# EAGLE design SimpleDuino (EAGLE 9.6.2)
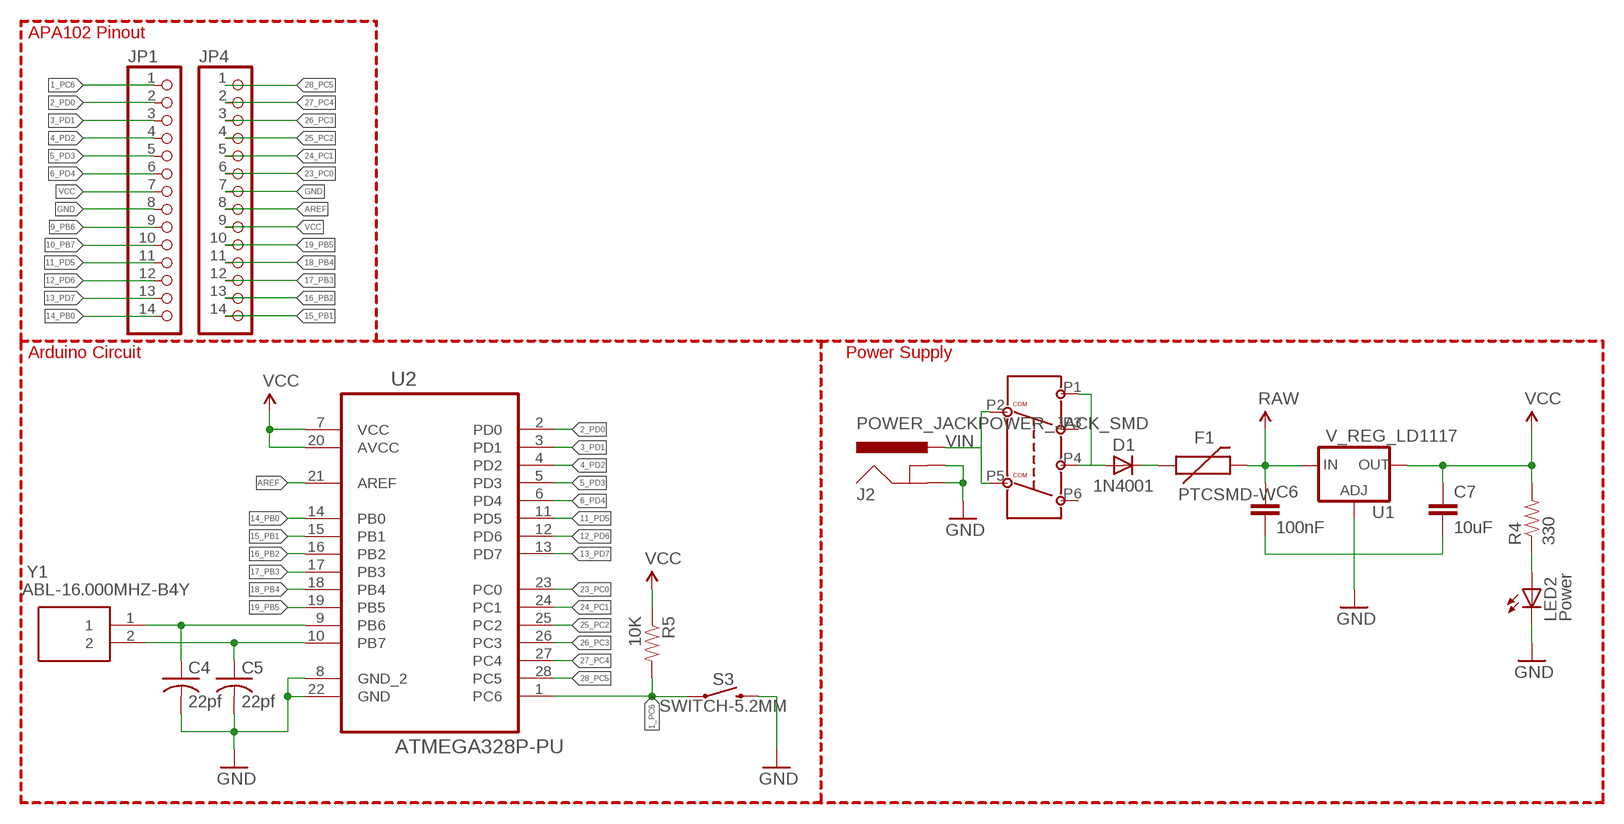
[diagram p0: schematic, sheet 1]

## Parts
C4  22pf  C-USC0805  [C0805]
C5  22pf  C-USC0805  [C0805]
C6  100nF  CAP0603-CAP  [0603-CAP]
C7  10uF  CAP0603-CAP  [0603-CAP]
D1  1N4001  1N4004  [DO41-10]
F1  PTCSMD-W  [PTC-1206-WIDE]
J2  POWER_JACKPOWER_JACK_SMD  [POWER_JACK_SMD]
JP1  PINHD-1X14  [1X14]
JP4  PINHD-1X14  [1X14]
LED2  Power  LED1206  [LED-1206]
POWER_SWITCH  6-PIN-SLIDE-SWITCH  [6-PIN-SLIDE-SWITCH]
R4  330  RESISTOR0603-RES  [0603-RES]
R5  10K  RESISTOR0603-RES  [0603-RES]
S3  SWITCH-5.2MM  MOMENTARY-SWITCH-SPST-SMD-5.2MM  [TACTILE_SWITCH_SMD_5.2MM]
U1  V_REG_LD1117  V_REG_317SMD  [SOT223]
U2  ATMEGA328P-PU  [DIP254P762X457-28]
Y1  ABL-16.000MHZ-B4Y  [HC/49US_(AT49)PTH]

## Nets
1_PC6: JP1.1 R5.2 S3.1 U2.1(PC6)
2_PD0: JP1.2 U2.2(PD0)
3_PD1: JP1.3 U2.3(PD1)
4_PD2: JP1.4 U2.4(PD2)
5_PD3: JP1.5 U2.5(PD3)
6_PD4: JP1.6 U2.6(PD4)
9_PB6: C4.1 JP1.9 U2.9(PB6) Y1.1
10_PB7: C5.1 JP1.10 U2.10(PB7) Y1.2
11_PD5: JP1.11 U2.11(PD5)
12_PD6: JP1.12 U2.12(PD6)
13_PD7: JP1.13 U2.13(PD7)
14_PB0: JP1.14 U2.14(PB0)
15_PB1: JP4.14 U2.15(PB1)
16_PB2: JP4.13 U2.16(PB2)
17_PB3: JP4.12 U2.17(PB3)
18_PB4: JP4.11 U2.18(PB4)
19_PB5: JP4.10 U2.19(PB5)
23_PC0: JP4.6 U2.23(PC0)
24_PC1: JP4.5 U2.24(PC1)
25_PC2: JP4.4 U2.25(PC2)
26_PC3: JP4.3 U2.26(PC3)
27_PC4: JP4.2 U2.27(PC4)
28_PC5: JP4.1 U2.28(PC5)
AREF: JP4.8 U2.21(AREF)
GND: C4.2 C5.2 C6.2 C7.2 J2.GND J2.P$4(GNDBREAK) JP1.8 JP4.7 LED2.C S3.3 U1.1(ADJ) U2.8(GND_2) U2.22(GND)
N$1: D1.C F1.1
N$8: LED2.A R4.1
N$9: D1.A POWER_SWITCH.P1 POWER_SWITCH.P4
RAW: C6.1 F1.2 U1.3(IN)
VCC: C7.1 JP1.7 JP4.9 R4.2 R5.1 U1.2(OUT) U2.7(VCC) U2.20(AVCC)
VIN: J2.VIN0(PWR) POWER_SWITCH.P2 POWER_SWITCH.P5
Unconnected: POWER_SWITCH.P3 POWER_SWITCH.P6

## Notes on the sheet
- APA102 Pinout
- Arduino Circuit | Power Supply

## Library data of the parts
C4 C5 = resistor:C-US: CAPACITOR, American symbol
C6 C7 = SparkFun:CAP: Capacitor Standard 0603 ceramic capacitor, and 0.1" leaded capacitor.
D1 = adafruit:1N4004: DIODE General purpose 1N400x type rectifier (With bigger pads) http://www.ladyada.net/library/pcb/eaglelibrary.html
F1 = SparkFun-PowerIC:PTC: Resettable Fuse PTC Resettable Fuse. Spark Fun Electronics SKU : COM-08357
J2 = Magister-Libraries:POWER_JACK: Power Jack Connector This is the standard 5.5mm barrel jack for power. The PTH is the most common, proven, reliable, footprint. The Slot footprint only works if the mill layer is transmitted to the PCB fab house so be warned. Here are the connectors we sell at SparkFun: DC Barrel Power Jack/Connector <https://www.sparkfun.com/products/119> (PRT-00119) DC Barrel Power Jack/Connector (SMD) <https://www.sparkfun.com/products/12748> (PRT-12748) DC Barrel Jack Adapter - Breadboard Compatible <https://www.sparkfun.com/products/10811> (PRT-10811) It is used on this SparkFun product (and many, many others): SparkFun RedBoard - Programmed with Arduino <https://www.sparkfun.com/products/12757> (DEV-12757) Also, if you need a mating power supply or connector, please check these out: Wall Adapter Power Supply - 9VDC 650mA <https://www.sparkfun.com/products/298> (TOL-00298) DC Barrel Jack Adapter - Male <https://www.sparkfun.com/products/10287> (PRT-10287)
JP1 JP4 = pinhead:PINHD-1X14: PIN HEADER
LED2 = SparkFun-Nate:LED
POWER_SWITCH = Magister-Libraries:6-PIN-SLIDE-SWITCH
R4 R5 = SparkFun:RESISTOR: Resistor Basic schematic elements and footprints for 0603, 1206, and PTH resistors.
S3 = SparkFun-Switches:MOMENTARY-SWITCH-SPST: Momentary Switch (Pushbutton) - SPST Normally-open (NO) SPST momentary switches (buttons, pushbuttons). Variants PTH-12MM - 12mm square, through-hole Momentary Pushbutton Switch - 12mm Square <https://www.sparkfun.com/products/9190> (COM-09190) PTH-6.0MM, PTH-6.0MM-KIT - 6.0mm square, through-hole Mini Pushbutton Switch <https://www.sparkfun.com/products/97> (COM-00097) KIT package intended for soldering kit's - only one side of pads' copper is exposed. PTH-RIGHT-ANGLE-KIT - Right-angle, through-hole Right Angle Tactile Button <https://www.sparkfun.com/products/10791> - Used on SparkFun BigTime Watch Kit <https://www.sparkfun.com/products/11734> SMD-12MM - 12mm square, surface-mount Tactile Button - SMD (12mm) <https://www.sparkfun.com/products/12993> (COM-12993) Used on SparkFun PicoBoard <https://www.sparkfun.com/products/11888> SMD-4.5MM - 4.5mm Square Trackball Switch Used on SparkFun Blackberry Trackballer Breakout <https://www.sparkfun.com/products/13169> SMD-4.6MMX2.8MM - 4.60mm x 2.80mm, surface mount Used on SparkFun SAMD21 Mini Breakout <https://www.sparkfun.com/products/13664> SMD-5.2MM, SMD-5.2-REDUNDANT - 5.2mm square, surface-mount Mini Pushbutton Switch - SMD <https://www.sparkfun.com/products/8720> (COM-08720) Used on Arduino Pro Mini <https://www.sparkfun.com/products/11114> REDUNDANT package connects both switch circuits together SMD-6.0X3.5MM - 6.0 x 3.5mm, surface mount Momentary Reset Switch SMD <https://www.sparkfun.com/products/8229> (COM-08229) SMD-6.2MM-TALL - 6.2mm square, surface mount Tactile Button - SMD (6mm) <https://www.sparkfun.com/products/12992> Used on SparkFun Digital Sandbox <https://www.sparkfun.com/products/12651> SMD-RIGHT-ANGLE - Right-angle, surface mount Used on SparkFun Block for Intel® Edison - Arduino <https://www.sparkfun.com/products/13036>; PROD_ID: SWCH-08247; SF_SKU: COM-08720
U1 = SparkFun:V_REG_317: Voltage Regulator Standard LM317 adjustable voltage regulator. AOI (Adjust Output Input). Google 'LM317 Calculator' for easy to use app to get the two resistor values needed. 240/720 for 5V output. 240/390 for 3.3V output. Spark Fun Electronics SKU : COM-00527
U2 = ATMEGA328P-PU:ATMEGA328P-PU: 8-bit Microcontroller with In-System Programmable Flash; AVAILABILITY: Unavailable; DESCRIPTION: AVR AVR® ATmega Microcontroller IC 8-Bit 20MHz 32KB _16K x 16_ FLASH 28-PDIP; MF: Microchip; MP: ATMEGA328P-PU; PACKAGE: PDIP-28 Microchip; PRICE: None
Y1 = Magister-Libraries:ABL-16.000MHZ-B4Y: Crystals 16.000MHZ, 18pF 30ppm -20C +70C Source: Datasheet <https://abracon.com/Resonators/ABL.pdf>; DESCRIPTION: Crystals 16.000MHZ, 18pF 30ppm -20C +70C; HEIGHT: mm; MANUFACTURER_NAME: ABRACON; MANUFACTURER_PART_NUMBER: ABL-16.000MHz-B4Y; MOUSER_PART_NUMBER: 815-ABL-16-B4Y; MOUSER_PRICE-STOCK: https://www.mouser.co.uk/ProductDetail/ABRACON/ABL-16000MHz-B4Y?qs=DZ%2FvJMgWWIsyUPmWNxNaQw%3D%3D

## Net classes
0 default: width 0.203 mm
1 power: width 0.508 mm

## Board
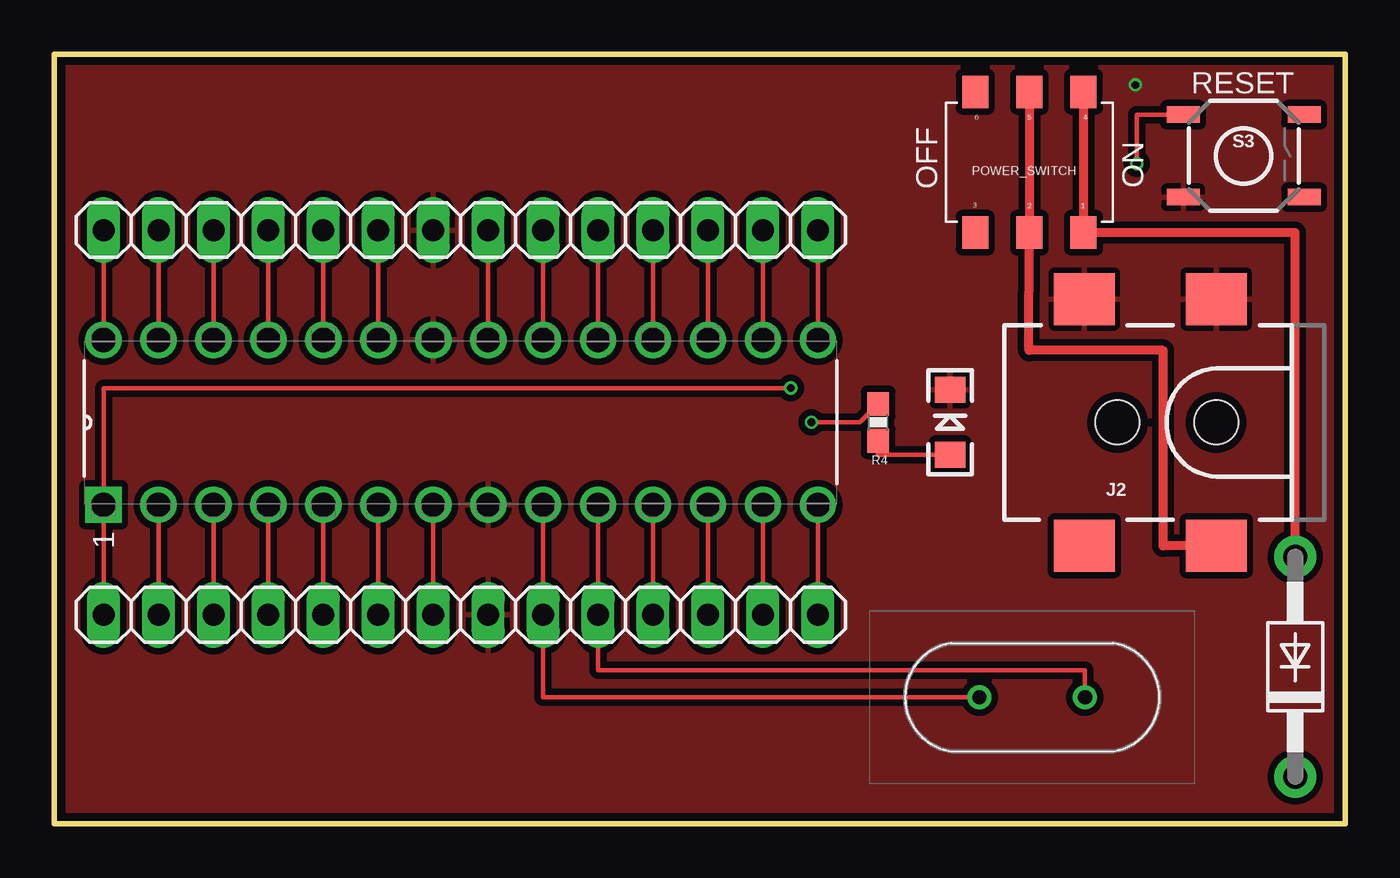
[diagram p1: board, top side]
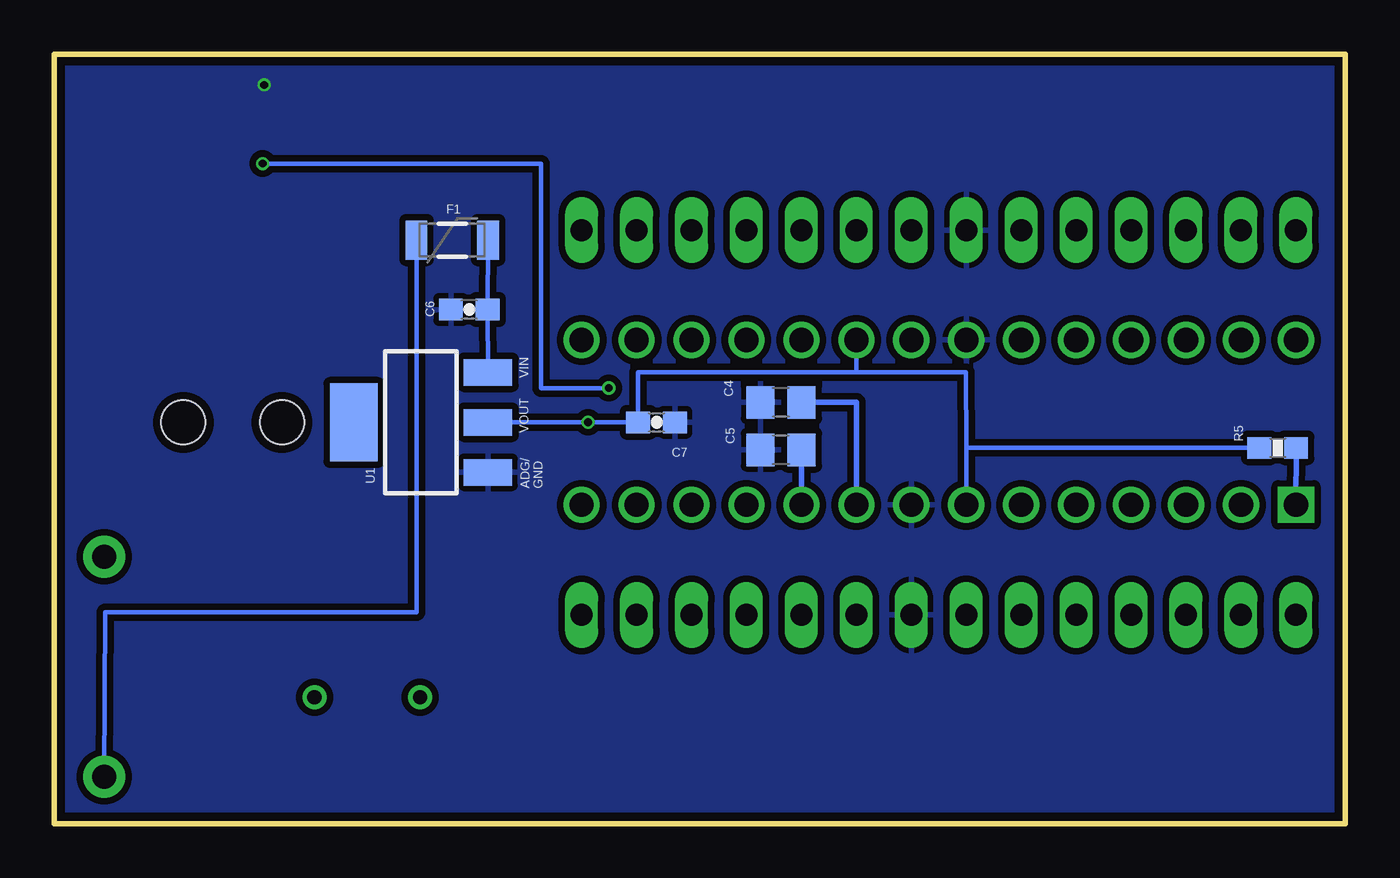
[diagram p2: board, bottom side, seen from below]

Size 59.69 x 35.56 mm. Coordinates in mm from the lower left corner, seen from the top.
Outline: 0,0 59.69,0 59.69,35.56 0,35.56 0,0
Copper layers (1*16): Top 0.035559375mm / dielectric 1.6mm / Bottom 0.035559375mm
Design rules "oshpark-2layer": minimum track width 6mil, minimum drill 10mil, track to track 6mil, track to pad 6mil, pad to pad 6mil, via to via 6mil, smd to smd 6mil, copper to edge 15mil, drill to drill 6mil, minimum pad ring 5mil, minimum via ring 5mil, stop-mask expansion 2.5mil, vias tented up to drill 0mil, thermal gap 10mil

### Footprints (pad centres in the part's own frame; a part is rotated, then mirrored left to right if it is on the bottom)
C0805 = smd 1.3 x 1.5: 1 -0.95,0; 2 0.95,0
0603-CAP = smd 1.1 x 1: 1 -0.85,0; 2 0.85,0
DO41-10 = drill 1.118 pad 1.93: A 5.08,0; C -5.08,0
PTC-1206-WIDE = smd 1 x 1.8: 1 -1.654,0; 2 1.654,0
POWER_JACK_SMD = smd 2.8 x 2.4: GND 0,-5.7; P$4 6.1,-5.7; VIN0 0,5.7; VIN1 6.1,5.7 | hole 2.032: 0,0; 4.572,0
1X14 = drill 1.016 long: 1 -16.51,0; 2 -13.97,0; 3 -11.43,0; 4 -8.89,0; 5 -6.35,0; 6 -3.81,0; 7 -1.27,0; 8 1.27,0; 9 3.81,0; 10 6.35,0; 11 8.89,0; 12 11.43,0; 13 13.97,0; 14 16.51,0
LED-1206 = smd 1.2 x 1.4: A -1.5,0; C 1.5,0
6-PIN-SLIDE-SWITCH = smd 1.2 x 1.5: P1 -2.5,3.25; P2 0,3.25; P3 2.5,3.25; P4 -2.5,-3.25; P5 0,-3.25; P6 2.5,-3.25
0603-RES = smd 1.1 x 1: 1 -0.85,0; 2 0.85,0
TACTILE_SWITCH_SMD_5.2MM = smd 1.524 x 0.762: 1 -2.794,1.905; 2 2.794,1.905; 3 -2.794,-1.905; 4 2.794,-1.905
SOT223 = smd 1.219 x 2.235: 1 -2.311,-3.099; 2 0,-3.099; 3 2.311,-3.099 | smd 3.6 x 2.2: 4 0,3.099
DIP254P762X457-28 = drill 1.118 square: 1 -7.62,33.02 | drill 1.118: 2 -7.62,30.48; 3 -7.62,27.94; 4 -7.62,25.4; 5 -7.62,22.86; 6 -7.62,20.32; 7 -7.62,17.78; 8 -7.62,15.24; 9 -7.62,12.7; 10 -7.62,10.16; 11 -7.62,7.62; 12 -7.62,5.08; 13 -7.62,2.54; 14 -7.62,0; 15 0,0; 16 0,2.54; 17 0,5.08; 18 0,7.62; 19 0,10.16; 20 0,12.7; 21 0,15.24; 22 0,17.78; 23 0,20.32; 24 0,22.86; 25 0,25.4; 26 0,27.94; 27 0,30.48; 28 0,33.02
HC/49US_(AT49)PTH = drill 0.66 pad 1.1: 1 -2.44,0; 2 2.44,0

### Placement (x,y rotation side)
C4  26.09,19.46 180 bottom
C5  26.09,17.27 180 bottom
C6  40.5,23.76 180 bottom
C7  31.84,18.54 0 bottom
D1  57.37,7.25 90 top
F1  41.28,26.96 0 bottom
J2  53.72,18.54 180 top
JP1  18.8,9.65 0 top
JP4  18.8,27.43 0 top
LED2  41.42,18.54 90 top
POWER_SWITCH  45.08,30.56 180 top
R4  38.09,18.54 90 top
R5  3.13,17.36 0 bottom
S3  54.99,30.86 0 top
U1  42.73,18.54 90 bottom
U2  35.31,22.35 90 top
Y1  45.21,5.84 0 top

### Tracks (layer width: path | path; a pad name or v marks a point on that pad's centre or on a via)
1_PC6  (via drill 0.35)
  Top 0.203: JP1.1 U2.1 2.29,20.13 v34.05,20.13 | S3.1 50.05,32.76 v50.05,30.5
  Bottom 0.203: v50.05,30.5 37.18,30.5 37.18,20.13 v34.05,20.13
  Bottom 0.254: U2.1 R5.2
2_PD0
  Top 0.203: U2.2 JP1.2
3_PD1
  Top 0.203: U2.3 JP1.3
4_PD2
  Top 0.203: U2.4 JP1.4
5_PD3
  Top 0.203: U2.5 JP1.5
6_PD4
  Top 0.203: U2.6 JP1.6
9_PB6
  Top 0.203: U2.9 JP1.9 22.61,5.84 Y1.1
  Bottom 0.254: U2.9 22.61,19.47 C4.1
10_PB7
  Top 0.203: U2.10 JP1.10 25.15,7.09 47.65,7.09 Y1.2
  Bottom 0.254: U2.10 C5.1
11_PD5
  Top 0.203: JP1.11 U2.11
12_PD6
  Top 0.203: JP1.12 U2.12
13_PD7
  Top 0.203: U2.13 JP1.13
14_PB0
  Top 0.203: JP1.14 U2.14
15_PB1
  Top 0.203: JP4.14 U2.15
16_PB2
  Top 0.203: JP4.13 U2.16
17_PB3
  Top 0.203: JP4.12 U2.17
18_PB4
  Top 0.203: JP4.11 U2.18
19_PB5
  Top 0.203: JP4.10 U2.19
23_PC0
  Top 0.203: JP4.6 U2.23
24_PC1
  Top 0.203: JP4.5 U2.24
25_PC2
  Top 0.203: JP4.4 U2.25
26_PC3
  Top 0.203: JP4.3 U2.26
27_PC4
  Top 0.203: JP4.2 U2.27
28_PC5
  Top 0.203: JP4.1 U2.28
AREF
  Top 0.203: JP4.8 U2.21
GND  (via drill 0.35)
  other vias: 49.98,34.14
  pour Bottom (isolate 0.305): 0,35.44 59.69,35.55 59.69,0 0,0
  pour Top (isolate 0.305): 0,0 0,35.56 59.69,35.56 59.69,0
N$1
  Bottom 0.203: F1.1 42.94,9.76 57.32,9.76 D1.C
N$8
  Top 0.203: LED2.A 38.09,17.04 R4.1
N$9
  Top 0.406: POWER_SWITCH.P4 POWER_SWITCH.P1 57.37,27.31 D1.A
RAW
  Bottom 0.203: F1.2 C6.1 U1.3
VCC  (via drill 0.35)
  Top 0.203: JP4.9 U2.20 | JP1.7 U2.7 | R4.2 37.25,18.55 v35.01,18.55
  Bottom 0.203: U1.2 39.63,18.55 v35.01,18.55 34.99,18.54 C7.1 32.69,20.86 22.6,20.86 U2.20 22.61,20.87 17.54,20.87 17.53,17.36 | R5.1 17.53,17.36 | 17.53,17.36 U2.7
VIN
  Top 0.406: POWER_SWITCH.P5 POWER_SWITCH.P2 45.07,21.87 51.27,21.87 51.27,12.84 J2.VIN0

### Text on the board
tPlace: RESET | OFF | ON | 1
bPlace: VIN | VOUT | ADG/ / GND